# EAGLE design v1 (EAGLE 6.6.0)
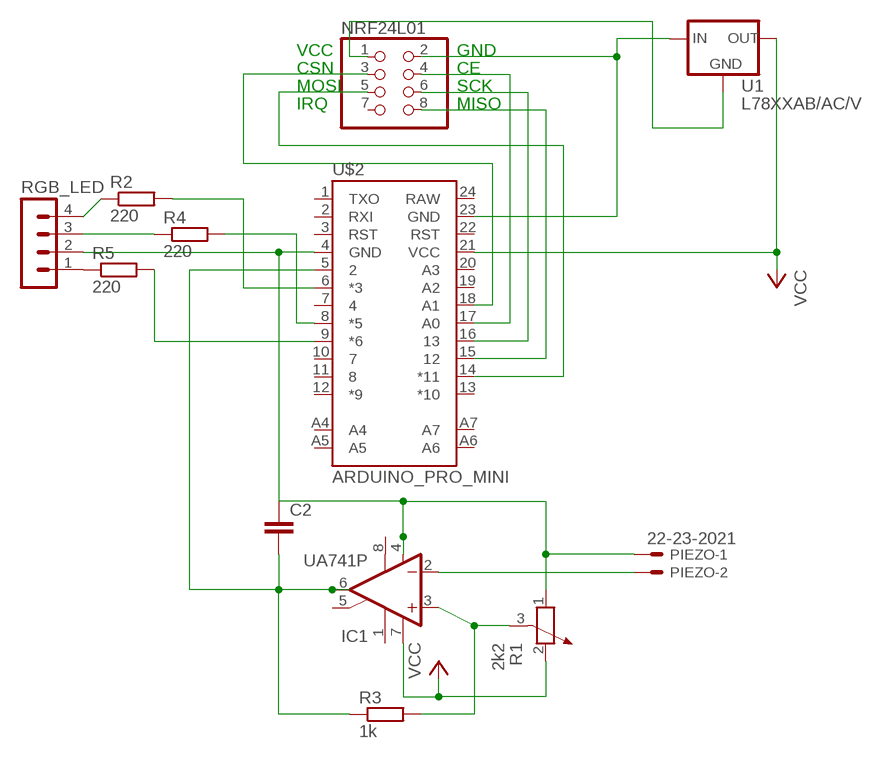
[diagram p0: schematic, sheet 1]

## Parts
C2  C-EU050-024X044  [C050-024X044]
IC1  UA741P  [DIL08]
NRF24L01  PINHD-2X4  [2X04]
PIEZO  22-23-2021  [22-23-2021]
R1  2k2  POTENTIOMETER_PT-10  [PT-10]
R2  220  R-EU_0207/10  [0207/10]
R3  1k  R-EU_0207/10  [0207/10]
R4  220  R-EU_0207/10  [0207/10]
R5  220  R-EU_0207/10  [0207/10]
RGB_LED  MA04-1  [MA04-1]
U1  L78XXAB/AC/V  [78XXS]
U$2  ARDUINO_PRO_MINI  [ARDUINO_PRO_MINI]

## Nets
N$1: NRF24L01.6 U$2.16
N$2: NRF24L01.8 U$2.15
N$3: NRF24L01.5 U$2.14(*11)
N$5: NRF24L01.4 U$2.17(A0)
N$6: R2.1 RGB_LED.4
N$7: R4.1 RGB_LED.3
N$8: R5.1 RGB_LED.1
N$9: IC1.2(-IN) PIEZO.2
N$10: R2.2 U$2.6(*3)
N$11: R4.2 U$2.8(*5)
N$12: R5.2 U$2.9(*6)
N$13: C2.2 IC1.6(OUT) R3.1 U$2.5
N$14: NRF24L01.1 U1.GND
N$15: NRF24L01.3 U$2.18(A1)
N$16: IC1.3(+IN) R1.3 R3.2
N$17: NRF24L01.2 U1.IN U$2.23(GND)
N$18: C2.1 IC1.4(V-) PIEZO.1 R1.1 RGB_LED.2 U$2.4(GND)
VCC: IC1.7(V+) R1.2 U1.OUT U$2.21(VCC)
Unconnected: IC1.1(ON1) IC1.5(ON2) IC1.8(OPT) NRF24L01.7 U$2.1(TXO) U$2.2(RXI) U$2.3(RST) U$2.7 U$2.10 U$2.11 U$2.12(*9) U$2.13(*10) U$2.19(A2) U$2.20(A3) U$2.22(RST) U$2.24(RAW) U$2.A4 U$2.A5 U$2.A6 U$2.A7

## Notes on the sheet
- VCC | GND
- CSN | CE
- MOSI | SCK
- IRQ | MISO

## Library data of the parts
C2 = resistor:C-EU: CAPACITOR, European symbol
IC1 = linear:*741: OP AMP
NRF24L01 = pinhead:PINHD-2X4: PIN HEADER
PIEZO = con-molex:22-23-2021: .100" (2.54mm) Center Header - 2 Pin; MF: MOLEX; MPN: 22-23-2021; OC_FARNELL: 1462926; OC_NEWARK: 25C3832
R1 = rcl:POTENTIOMETER_: Potentiometer
R2-R5 = resistor:R-EU_: RESISTOR, European symbol
RGB_LED = con-lstb:MA04-1: PIN HEADER; OC_FARNELL: unknown; OC_NEWARK: unknown
U1 = v-reg:L78XX: VOLTAGE REGULATOR
U$2 = SparkFun-Boards:ARDUINO_PRO_MINI

## Board
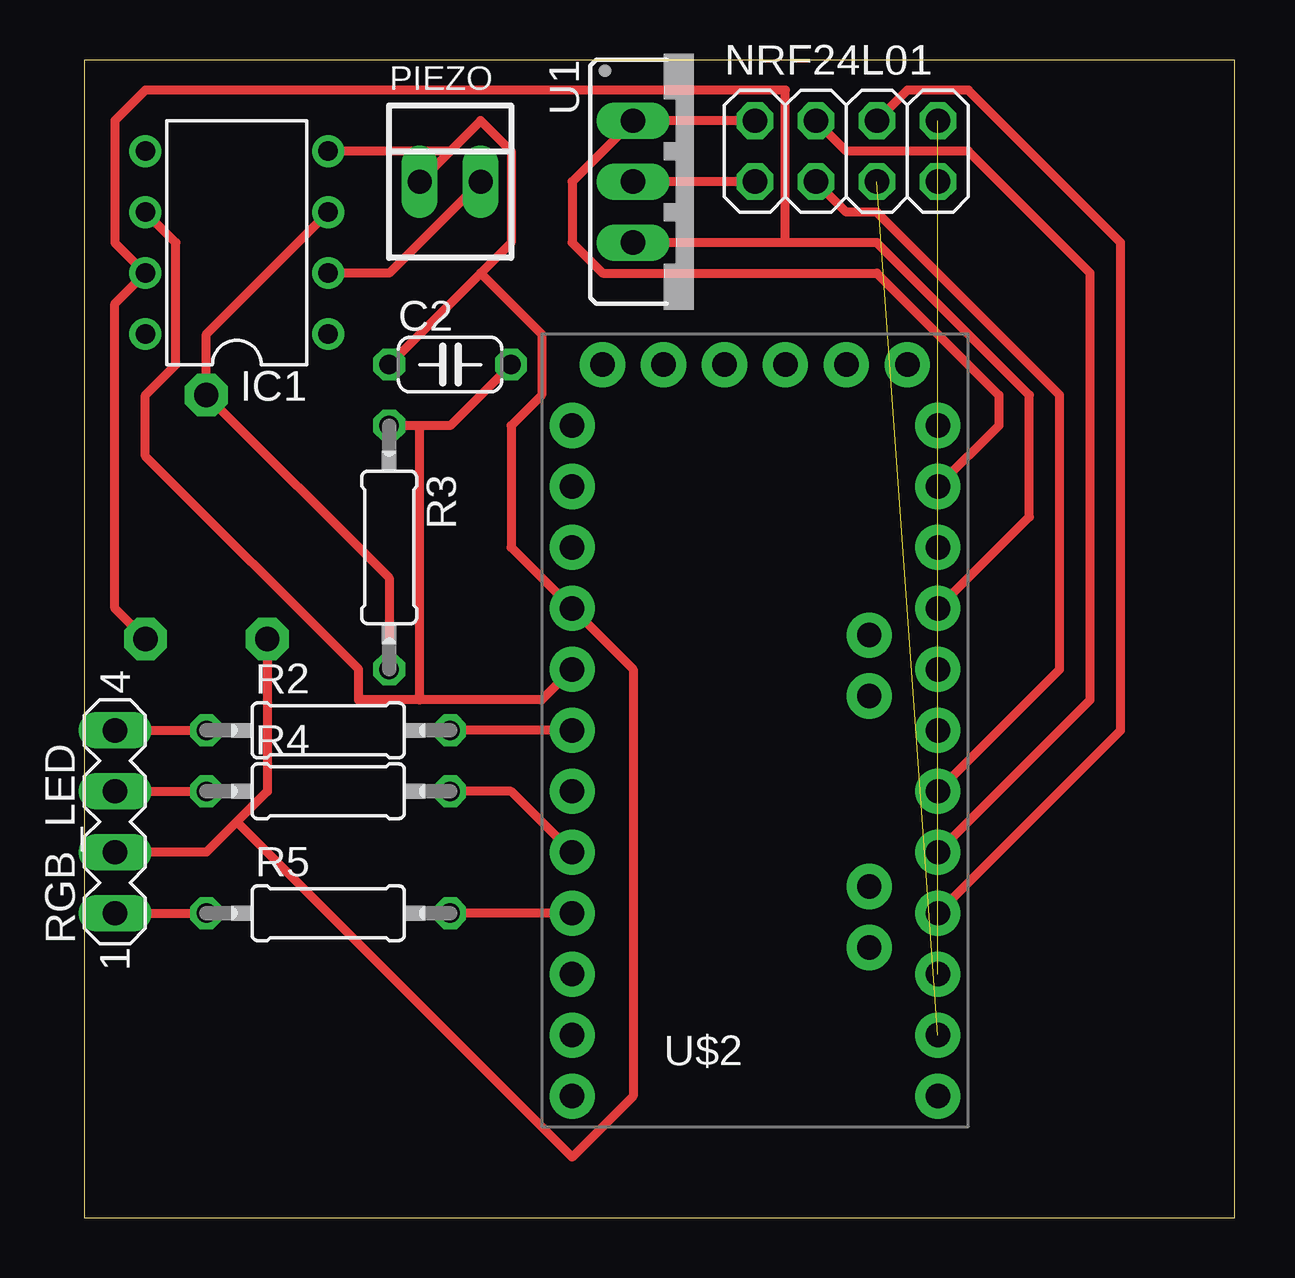
[diagram p1: board, top side]
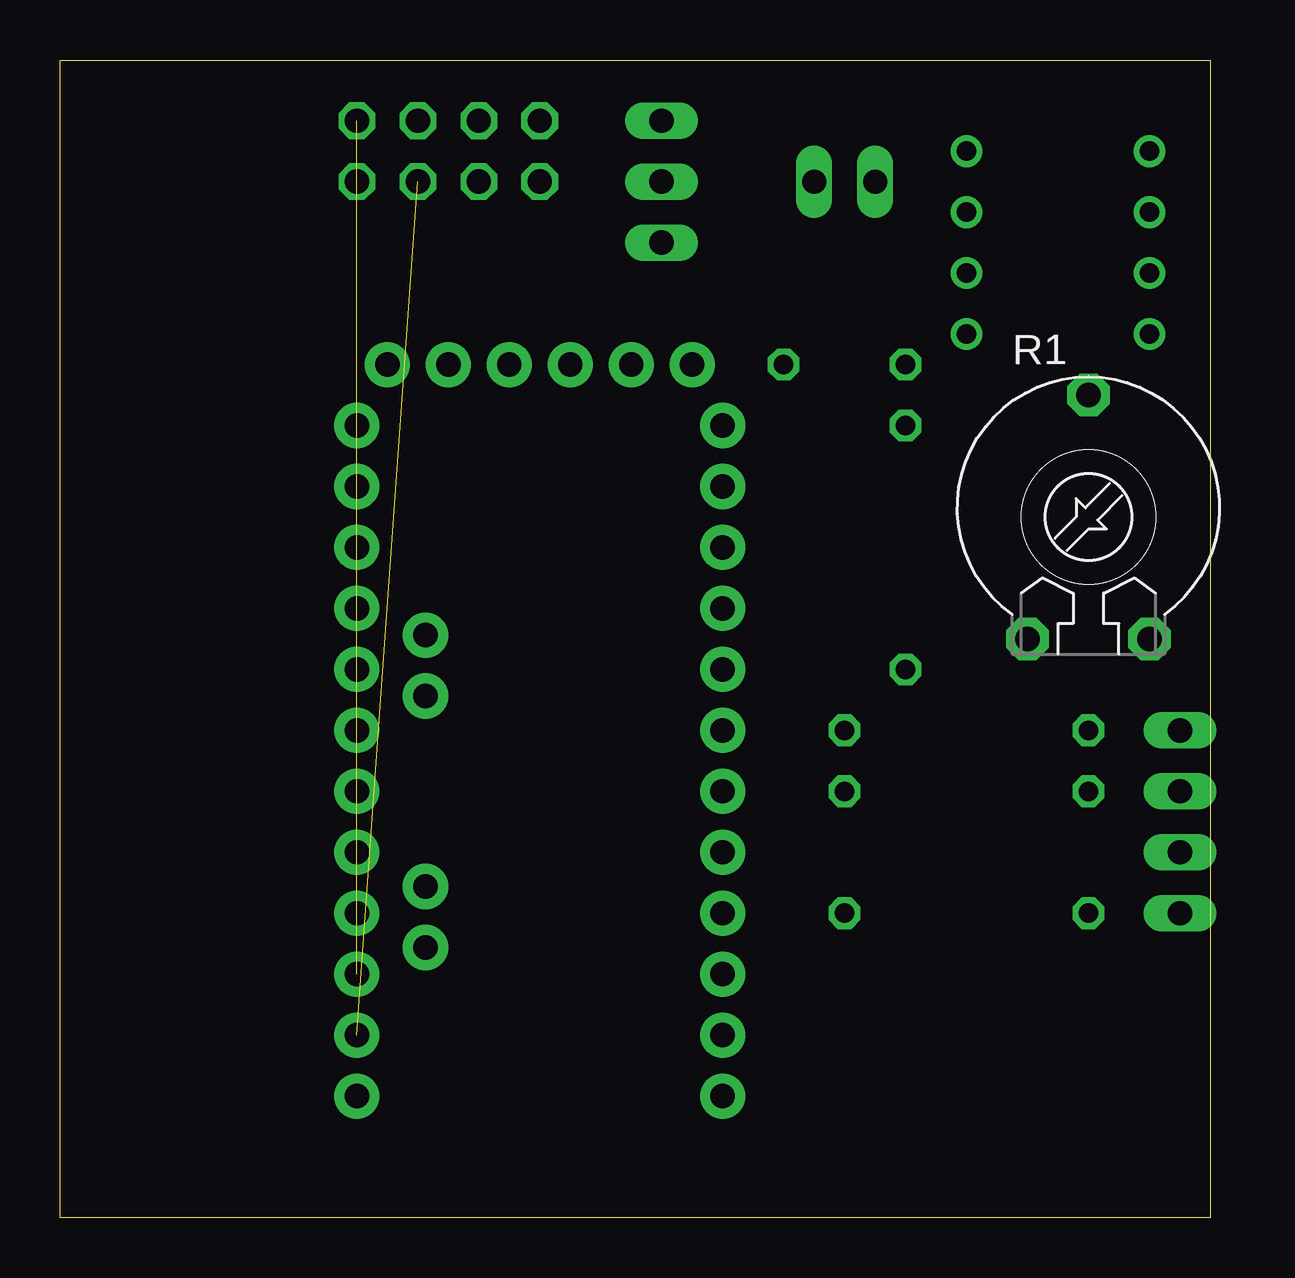
[diagram p2: board, bottom side, seen from below]

Size 47.93 x 48.25 mm. Coordinates in mm from the lower left corner, seen from the top.
Outline: 0,0 47.93,0 47.93,48.25 0,48.25 0,0
Copper layers (1*16): Top 0.05mm / dielectric 1.5mm / Bottom 0.05mm
Design rules "default *": minimum track width 15mil, minimum drill 24mil, track to track 8mil, track to pad 8mil, pad to pad 8mil, via to via 8mil, smd to smd 8mil, copper to edge 40mil, drill to drill 8mil, minimum pad ring 10mil, minimum via ring 8mil, stop-mask expansion 4mil, vias tented up to drill 0mil, thermal gap 10mil

### Footprints (pad centres in the part's own frame; a part is rotated, then mirrored left to right if it is on the bottom)
C050-024X044 = drill 0.813 octagon: 1 -2.54,0; 2 2.54,0
DIL08 = drill 0.813 pad 1.27: 1 -3.81,-3.81; 2 -1.27,-3.81; 3 1.27,-3.81; 4 3.81,-3.81; 5 3.81,3.81; 6 1.27,3.81; 7 -1.27,3.81; 8 -3.81,3.81
2X04 = drill 1.016 octagon: 1 -3.81,-1.27; 2 -3.81,1.27; 3 -1.27,-1.27; 4 -1.27,1.27; 5 1.27,-1.27; 6 1.27,1.27; 7 3.81,-1.27; 8 3.81,1.27
22-23-2021 = drill 1 long: 1 -1.27,0; 2 1.27,0
PT-10 = drill 1.016 pad 1.778 octagon: 1 -2.54,-5.08; 2 2.54,-5.08; 3 0,5.08
0207/10 = drill 0.813 octagon: 1 -5.08,0; 2 5.08,0
MA04-1 = drill 1.016 long: 1 -3.81,0; 2 -1.27,0; 3 1.27,0; 4 3.81,0
78XXS = drill 1.016 long: GND 0,-2.54; IN -2.54,-2.54; OUT 2.54,-2.54
ARDUINO_PRO_MINI = drill 1.016 pad 1.88: 1 -7.62,12.7; 2 -7.62,10.16; 3 -7.62,7.62; 4 -7.62,5.08; 5 -7.62,2.54; 6 -7.62,0; 7 -7.62,-2.54; 8 -7.62,-5.08; 9 -7.62,-7.62; 10 -7.62,-10.16; 11 -7.62,-12.7; 12 -7.62,-15.24; 13 7.62,-15.24; 14 7.62,-12.7; 15 7.62,-10.16; 16 7.62,-7.62; 17 7.62,-5.08; 18 7.62,-2.54; 19 7.62,0; 20 7.62,2.54; 21 7.62,5.08; 22 7.62,7.62; 23 7.62,10.16; 24 7.62,12.7; A4 4.763,1.429; A5 4.763,3.969; A6 4.763,-9.049; A7 4.763,-6.509; BLK -6.35,15.24; GND -3.81,15.24; GRN 6.35,15.24; RXI 1.27,15.24; TXO 3.81,15.24; VCC -1.27,15.24

### Placement (x,y rotation side)
C2  15.24,35.56 0 top
IC1  6.35,40.64 90 top
NRF24L01  31.75,44.45 0 top
PIEZO  15.24,43.18 0 top
R1  5.08,29.21 0 bottom
R2  10.16,20.32 0 top
R3  12.7,27.94 270 top
R4  10.16,17.78 0 top
R5  10.16,12.7 0 top
RGB_LED  1.27,16.51 90 top
U1  25.4,43.18 270 top
U$2  27.94,20.32 0 top

### Tracks (layer width: path | path; a pad name or v marks a point on that pad's centre or on a via)
N$1
  Top 0.381: NRF24L01.6 34.29,46.99 36.83,46.99 43.18,40.64 43.18,20.32 U$2.16
N$2  (1 unrouted)
N$3  (1 unrouted)
N$5
  Top 0.381: NRF24L01.4 31.75,44.45 36.83,44.45 41.91,39.37 41.91,21.59 U$2.17
N$6
  Top 0.381: RGB_LED.4 R2.1
N$7
  Top 0.381: RGB_LED.3 R4.1
N$8
  Top 0.381: RGB_LED.1 R5.1
N$9
  Top 0.381: IC1.2 12.7,39.37 PIEZO.2
N$10
  Top 0.381: U$2.6 R2.2
N$11
  Top 0.381: R4.2 17.78,17.78 U$2.8
N$12
  Top 0.381: U$2.9 R5.2
N$13
  Top 0.381: 13.97,33.02 15.24,33.02 C2.2 | 13.97,33.02 R3.1 | IC1.6 3.81,40.64 3.81,35.56 2.54,34.29 2.54,31.75 11.43,22.86 11.43,21.59 13.97,21.59 | 13.97,21.59 19.05,21.59 U$2.5 | 13.97,21.59 13.97,33.02
N$14
  Top 0.381: NRF24L01.1 U1.GND
N$15
  Top 0.381: NRF24L01.3 31.75,41.91 33.02,41.91 40.64,34.29 40.64,22.86 U$2.18
N$16
  Top 0.381: R3.2 12.7,26.67 R1.3 5.08,36.83 IC1.3
N$17
  Top 0.381: NRF24L01.2 U1.IN 20.32,43.18 20.32,40.64 21.59,39.37 33.02,39.37 38.1,34.29 38.1,33.02 U$2.23
N$18
  Top 0.381: RGB_LED.2 5.08,15.24 6.35,16.51 | 6.35,16.51 7.62,17.78 R1.1 | 16.51,39.37 17.78,40.64 17.78,44.45 16.51,45.72 15.24,44.45 | 16.51,39.37 C2.1 | PIEZO.1 15.24,44.45 | 15.24,44.45 IC1.4 | 16.51,39.37 19.05,36.83 19.05,34.29 17.78,33.02 17.78,27.94 U$2.4 22.86,22.86 22.86,5.08 20.32,2.54 6.35,16.51
VCC
  Top 0.381: R1.2 1.27,25.4 1.27,38.1 IC1.7 1.27,40.64 1.27,45.72 2.54,46.99 29.21,46.99 29.21,40.64 | 29.21,40.64 33.02,40.64 39.37,34.29 39.37,29.21 U$2.21 | 29.21,40.64 U1.OUT